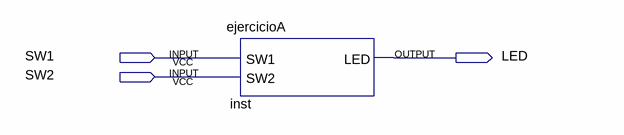
[diagram p0: schematic sheet]
// Quartus schematic diagrama.bdf as structural Verilog: 1 symbols, 3 pins
module diagrama (
  input  SW1,
  input  SW2,
  output LED
);

  ejercicioA inst (.SW1(SW1), .SW2(SW2), .LED(LED));
endmodule
